# Altium schematic sheet besc sch.SchDoc
size A4
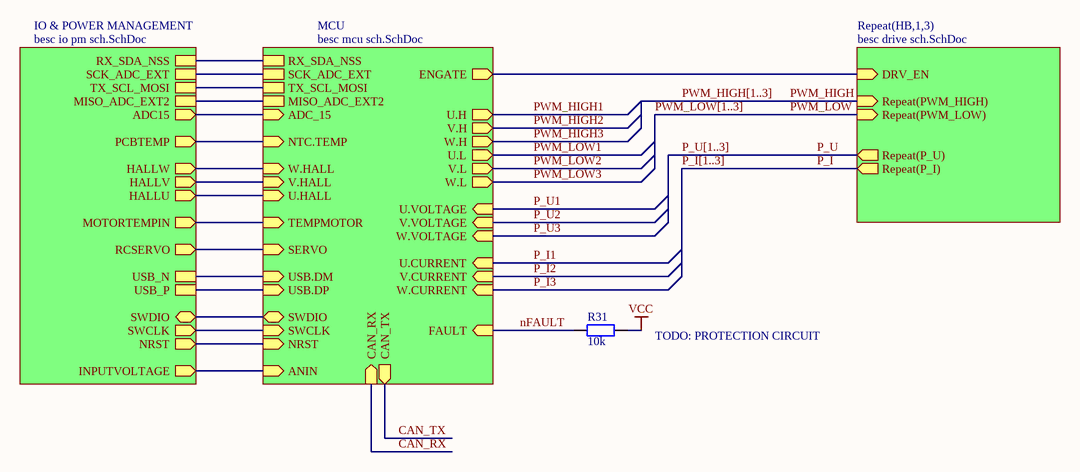
[diagram p0: besc sch.SchDoc]

## Parts
R31  10k  [0603]

## Sub-sheets
IO & POWER MANAGEMENT = besc io pm sch.SchDoc: USB_P, USB_N, PCBTEMP (out), HALLW (out), HALLV (out), HALLU (out), RCSERVO (out), NRST (out), SWCLK (out), SWDIO (bidir), RX_SDA_NSS, SCK_ADC_EXT, TX_SCL_MOSI, MISO_ADC_EXT2, MOTORTEMPIN (out), INPUTVOLTAGE (out), ADC15 (out)
MCU = besc mcu sch.SchDoc: W.VOLTAGE (in), V.VOLTAGE (in), U.VOLTAGE (in), W.H (out), V.H (out), U.H (out), W.L (out), V.L (out), U.L (out), V.CURRENT (in), U.CURRENT (in), ENGATE (out), FAULT (in), NTC.TEMP (in), SCK_ADC_EXT, MISO_ADC_EXT2, W.HALL (in), V.HALL (in), U.HALL (in), USB.DM (in), USB.DP (in), SWCLK (in), SWDIO (bidir), SERVO (in), CAN_RX (in), CAN_TX (out), TEMPMOTOR (in), ANIN (in), NRST (in), W.CURRENT (in), RX_SDA_NSS, TX_SCL_MOSI, ADC_15 (in)
Repeat(HB,1,3) = besc drive sch.SchDoc: Repeat(P_U) (out), Repeat(PWM_HIGH) (in), Repeat(PWM_LOW) (in), Repeat(P_I) (out), DRV_EN (in)

## Nets
VCC: R31.2
CAN_RX: sheet MCU/CAN_RX
CAN_TX: sheet MCU/CAN_TX
nFAULT: R31.1 ; sheet MCU/FAULT
P_I: sheet Repeat(HB,1,3)/Repeat(P_I)
P_I1: sheet MCU/U.CURRENT
P_I2: sheet MCU/V.CURRENT
P_I3: sheet MCU/W.CURRENT
P_U: sheet Repeat(HB,1,3)/Repeat(P_U)
P_U1: sheet MCU/U.VOLTAGE
P_U2: sheet MCU/V.VOLTAGE
P_U3: sheet MCU/W.VOLTAGE
PWM_HIGH: sheet Repeat(HB,1,3)/Repeat(PWM_HIGH)
PWM_HIGH1: sheet MCU/U.H
PWM_HIGH2: sheet MCU/V.H
PWM_HIGH3: sheet MCU/W.H
PWM_LOW: sheet Repeat(HB,1,3)/Repeat(PWM_LOW)
PWM_LOW1: sheet MCU/U.L
PWM_LOW2: sheet MCU/V.L
PWM_LOW3: sheet MCU/W.L
(unnamed): sheet MCU/ENGATE, sheet Repeat(HB,1,3)/DRV_EN
(unnamed): sheet MCU/NTC.TEMP, sheet IO & POWER MANAGEMENT/PCBTEMP
(unnamed): sheet MCU/SCK_ADC_EXT, sheet IO & POWER MANAGEMENT/SCK_ADC_EXT
(unnamed): sheet MCU/MISO_ADC_EXT2, sheet IO & POWER MANAGEMENT/MISO_ADC_EXT2
(unnamed): sheet MCU/W.HALL, sheet IO & POWER MANAGEMENT/HALLW
(unnamed): sheet MCU/V.HALL, sheet IO & POWER MANAGEMENT/HALLV
(unnamed): sheet MCU/U.HALL, sheet IO & POWER MANAGEMENT/HALLU
(unnamed): sheet MCU/USB.DM, sheet IO & POWER MANAGEMENT/USB_N
(unnamed): sheet MCU/USB.DP, sheet IO & POWER MANAGEMENT/USB_P
(unnamed): sheet MCU/SWCLK, sheet IO & POWER MANAGEMENT/SWCLK
(unnamed): sheet MCU/SWDIO, sheet IO & POWER MANAGEMENT/SWDIO
(unnamed): sheet MCU/SERVO, sheet IO & POWER MANAGEMENT/RCSERVO
(unnamed): sheet MCU/TEMPMOTOR, sheet IO & POWER MANAGEMENT/MOTORTEMPIN
(unnamed): sheet MCU/ANIN, sheet IO & POWER MANAGEMENT/INPUTVOLTAGE
(unnamed): sheet MCU/NRST, sheet IO & POWER MANAGEMENT/NRST
(unnamed): sheet MCU/RX_SDA_NSS, sheet IO & POWER MANAGEMENT/RX_SDA_NSS
(unnamed): sheet MCU/TX_SCL_MOSI, sheet IO & POWER MANAGEMENT/TX_SCL_MOSI
(unnamed): sheet MCU/ADC_15, sheet IO & POWER MANAGEMENT/ADC15

## Buses and harness runs
bus P_I[1..3]
bus P_U[1..3]
bus PWM_HIGH[1..3]
bus PWM_LOW[1..3]

## Notes on the sheet
- (near R31) TODO: PROTECTION CIRCUIT

## Library data of the parts
R31 = Res2: Resistor; Published: 8-Jun-2000; LatestRevisionDate: 17-Jul-2002; LatestRevisionNote: Re-released for DXP Platform.; PackageReference: AXIAL-0.4; Publisher: Altium Limited; PackageDescription: Axial Device, Thru-Hole; 2 Leads; 0.4 in Pin Spacing